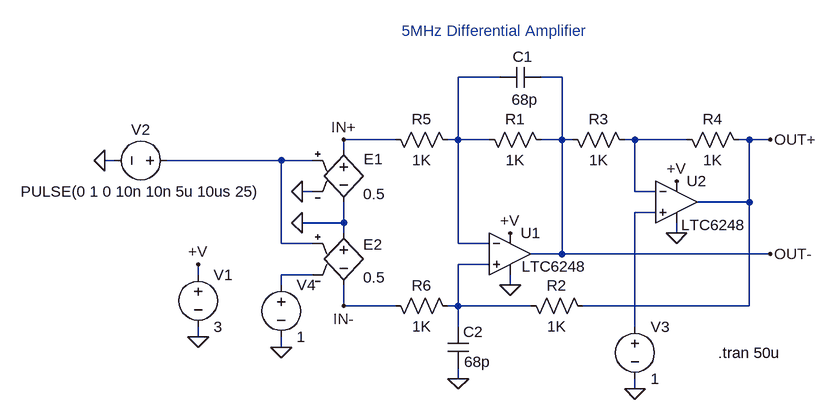
[diagram p0: schematic 6248.asc]
6248.asc, the LTspice schematic file:
Version 4
SHEET 1 888 688
WIRE -10976 -3072 -11040 -3072
WIRE -10880 -3072 -10912 -3072
WIRE -11136 -2976 -11216 -2976
WIRE -11040 -2976 -11040 -3072
WIRE -11040 -2976 -11056 -2976
WIRE -10992 -2976 -11040 -2976
WIRE -10880 -2976 -10880 -3072
WIRE -10880 -2976 -10912 -2976
WIRE -10864 -2976 -10880 -2976
WIRE -10768 -2976 -10784 -2976
WIRE -10688 -2976 -10768 -2976
WIRE -10592 -2976 -10608 -2976
WIRE -10560 -2976 -10592 -2976
WIRE -11216 -2960 -11216 -2976
WIRE -11568 -2944 -11584 -2944
WIRE -11312 -2944 -11488 -2944
WIRE -11264 -2944 -11312 -2944
WIRE -11264 -2896 -11280 -2896
WIRE -10768 -2896 -10768 -2976
WIRE -10736 -2896 -10768 -2896
WIRE -10592 -2880 -10592 -2976
WIRE -10592 -2880 -10672 -2880
WIRE -10736 -2864 -10768 -2864
WIRE -11216 -2848 -11216 -2880
WIRE -11216 -2848 -11280 -2848
WIRE -11216 -2832 -11216 -2848
WIRE -10704 -2832 -10704 -2848
WIRE -11312 -2816 -11312 -2944
WIRE -11264 -2816 -11312 -2816
WIRE -11040 -2816 -11040 -2976
WIRE -10992 -2816 -11040 -2816
WIRE -10880 -2800 -10880 -2976
WIRE -10880 -2800 -10928 -2800
WIRE -10560 -2800 -10880 -2800
WIRE -10992 -2784 -11040 -2784
WIRE -11440 -2768 -11440 -2784
WIRE -11264 -2768 -11312 -2768
WIRE -11312 -2752 -11312 -2768
WIRE -10960 -2752 -10960 -2768
WIRE -11216 -2720 -11216 -2752
WIRE -11136 -2720 -11216 -2720
WIRE -11040 -2720 -11040 -2784
WIRE -11040 -2720 -11056 -2720
WIRE -10928 -2720 -11040 -2720
WIRE -10592 -2720 -10592 -2880
WIRE -10592 -2720 -10848 -2720
WIRE -11040 -2688 -11040 -2720
WIRE -10768 -2688 -10768 -2864
WIRE -11440 -2672 -11440 -2688
WIRE -11312 -2656 -11312 -2672
WIRE -11040 -2608 -11040 -2624
WIRE -10768 -2592 -10768 -2608
FLAG -11440 -2672 0
FLAG -11440 -2784 +V
FLAG -10960 -2752 0
FLAG -10704 -2832 0
FLAG -11040 -2608 0
FLAG -10768 -2592 0
FLAG -11312 -2656 0
FLAG -11584 -2944 0
FLAG -11280 -2848 0
FLAG -11280 -2896 0
FLAG -11216 -2976 IN+
FLAG -11216 -2720 IN-
FLAG -10560 -2976 OUT+
FLAG -10560 -2800 OUT-
FLAG -10960 -2832 +V
FLAG -10704 -2912 +V
SYMBOL voltage -11440 -2784 R0
WINDOW 123 24 146 Left 2
WINDOW 39 24 125 Left 2
SYMATTR InstName V1
SYMATTR Value 3
SYMBOL RES -10896 -2960 M270
WINDOW 0 32 56 VTop 2
WINDOW 3 0 56 VBottom 2
SYMATTR InstName R1
SYMATTR Value 1K
SYMBOL RES -10832 -2704 M270
WINDOW 0 32 56 VTop 2
WINDOW 3 0 56 VBottom 2
SYMATTR InstName R2
SYMATTR Value 1K
SYMBOL cap -10912 -3088 R90
WINDOW 0 0 29 VBottom 2
WINDOW 3 35 25 VTop 2
SYMATTR InstName C1
SYMATTR Value 68p
SYMBOL RES -10880 -2992 M90
WINDOW 0 0 56 VBottom 2
WINDOW 3 32 56 VTop 2
SYMATTR InstName R3
SYMATTR Value 1K
SYMBOL cap -11056 -2688 R0
WINDOW 3 25 54 Left 2
SYMATTR Value 68p
SYMATTR InstName C2
SYMBOL RES -10704 -2992 M90
WINDOW 0 0 56 VBottom 2
WINDOW 3 32 56 VTop 2
SYMATTR InstName R4
SYMATTR Value 1K
SYMBOL VOLTAGE -11472 -2944 R90
WINDOW 0 -32 56 VBottom 2
WINDOW 3 32 56 VTop 2
WINDOW 39 53 56 VTop 2
WINDOW 123 74 56 VTop 2
SYMATTR InstName V2
SYMATTR Value PULSE(0 1 0 10n 10n 5u 10us 25)
SYMBOL RES -11040 -2960 M270
WINDOW 0 32 56 VTop 2
WINDOW 3 0 56 VBottom 2
SYMATTR InstName R5
SYMATTR Value 1K
SYMBOL RES -11152 -2736 M90
WINDOW 0 0 56 VBottom 2
WINDOW 3 32 56 VTop 2
SYMATTR InstName R6
SYMATTR Value 1K
SYMBOL voltage -10768 -2704 R0
WINDOW 123 24 146 Left 2
WINDOW 39 24 125 Left 2
SYMATTR InstName V3
SYMATTR Value 1
SYMBOL e -11216 -2976 R0
WINDOW 0 31 30 Left 2
WINDOW 3 30 84 Left 2
SYMATTR InstName E1
SYMATTR Value 0.5
SYMBOL e -11216 -2848 R0
WINDOW 0 30 33 Left 2
WINDOW 3 30 84 Left 2
SYMATTR InstName E2
SYMATTR Value 0.5
SYMBOL voltage -11312 -2768 R0
WINDOW 123 24 146 Left 2
WINDOW 39 24 125 Left 2
SYMATTR InstName V4
SYMATTR Value 1
SYMBOL LTC6248 -10960 -2800 R0
WINDOW 3 68 19 Center 2
SYMATTR InstName U1
SYMBOL LTC6248 -10704 -2880 R0
WINDOW 3 57 35 Center 2
SYMATTR InstName U2
TEXT -10640 -2648 Left 2 !.tran 50u
TEXT -10984 -3128 Bottom 2 ;5MHz Differential Amplifier

The netlist it stands for:
* 6248.asc
V1 +V 0 3
R1 OUT- N001 1K
R2 OUT+ N005 1K
C1 OUT- N001 68p
R3 OUT- N002 1K
C2 N005 0 68p
R4 N002 OUT+ 1K
V2 N003 0 PULSE(0 1 0 10n 10n 5u 10us 25)
R5 N001 IN+ 1K
R6 IN- N005 1K
V3 N004 0 1
E1 IN+ 0 N003 0 0.5
E2 0 IN- N003 N006 0.5
V4 N006 0 1
* U1: LTC6248 (symbol LTC6248 not available, pins judged from their places): In+=N005 In-=N001 V+=+V V-=0 OUT=OUT-
* U2: LTC6248 (symbol LTC6248 not available, pins judged from their places): In+=N004 In-=N002 V+=+V V-=0 OUT=OUT+
.tran 50u
* 5MHz Differential Amplifier
.backanno
.end